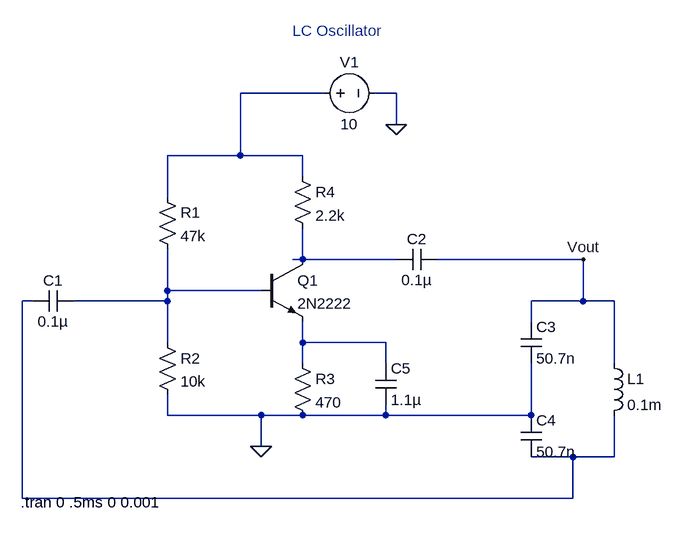
[diagram p0: schematic Draft1.asc]
Draft1.asc, the LTspice schematic file:
Version 4
SHEET 1 1072 680
WIRE 544 -160 416 -160
WIRE 656 -160 624 -160
WIRE 656 -112 656 -160
WIRE 416 -64 416 -160
WIRE 416 -64 304 -64
WIRE 512 -64 416 -64
WIRE 512 -32 512 -64
WIRE 304 0 304 -64
WIRE 512 96 512 48
WIRE 512 96 496 96
WIRE 656 96 512 96
WIRE 944 96 720 96
WIRE 304 144 304 80
WIRE 448 144 304 144
WIRE 96 160 80 160
WIRE 304 160 304 144
WIRE 304 160 160 160
WIRE 944 160 944 96
WIRE 944 160 864 160
WIRE 992 160 944 160
WIRE 864 192 864 160
WIRE 304 224 304 160
WIRE 512 224 512 192
WIRE 640 224 512 224
WIRE 512 256 512 224
WIRE 640 256 640 224
WIRE 992 256 992 160
WIRE 304 336 304 304
WIRE 448 336 304 336
WIRE 512 336 448 336
WIRE 640 336 640 320
WIRE 640 336 512 336
WIRE 864 336 864 256
WIRE 864 336 640 336
WIRE 448 384 448 336
WIRE 928 400 864 400
WIRE 992 400 992 336
WIRE 992 400 928 400
WIRE 80 464 80 160
WIRE 928 464 928 400
WIRE 928 464 80 464
FLAG 656 -112 0
FLAG 448 384 0
FLAG 944 96 Vout
SYMBOL cap 160 144 R90
WINDOW 0 0 32 VBottom 2
WINDOW 3 32 32 VTop 2
SYMATTR InstName C1
SYMATTR Value 0.1µ
SYMBOL res 288 -16 R0
SYMATTR InstName R1
SYMATTR Value 47k
SYMBOL res 288 208 R0
SYMATTR InstName R2
SYMATTR Value 10k
SYMBOL npn 448 96 R0
SYMATTR InstName Q1
SYMATTR Value 2N2222
SYMBOL res 496 240 R0
SYMATTR InstName R3
SYMATTR Value 470
SYMBOL res 496 -48 R0
SYMATTR InstName R4
SYMATTR Value 2.2k
SYMBOL cap 720 80 R90
WINDOW 0 0 32 VBottom 2
WINDOW 3 32 32 VTop 2
SYMATTR InstName C2
SYMATTR Value 0.1µ
SYMBOL cap 848 192 R0
SYMATTR InstName C3
SYMATTR Value 50.7n
SYMBOL cap 848 336 R0
SYMATTR InstName C4
SYMATTR Value 50.7n
SYMBOL ind 976 240 R0
SYMATTR InstName L1
SYMATTR Value 0.1m
SYMBOL cap 624 256 R0
SYMATTR InstName C5
SYMATTR Value 1.1µ
SYMBOL voltage 528 -160 R270
WINDOW 0 32 56 VTop 2
WINDOW 3 -32 56 VBottom 2
WINDOW 123 0 0 Left 0
WINDOW 39 0 0 Left 0
SYMATTR InstName V1
SYMATTR Value 10
TEXT 78 470 Left 2 !.tran 0 .5ms 0 0.001
TEXT 496 -256 Left 2 ;LC Oscillator

The netlist it stands for:
* Draft1.asc
C1 N003 N004 0.1µ
R1 N001 N003 47k
R2 N003 0 10k
Q1 N002 N003 N005 0 2N2222
R3 N005 0 470
R4 N001 N002 2.2k
C2 Vout N002 0.1µ
C3 Vout 0 50.7n
C4 0 N004 50.7n
L1 Vout N004 0.1m
C5 N005 0 1.1µ
V1 N001 0 10
.model NPN NPN
.model PNP PNP
.lib standard.bjt
.tran 0 .5ms 0 0.001
* LC Oscillator
.backanno
.end